# Altium schematic sheet bloodhound_gprs_0_beta.SchDoc
size A4
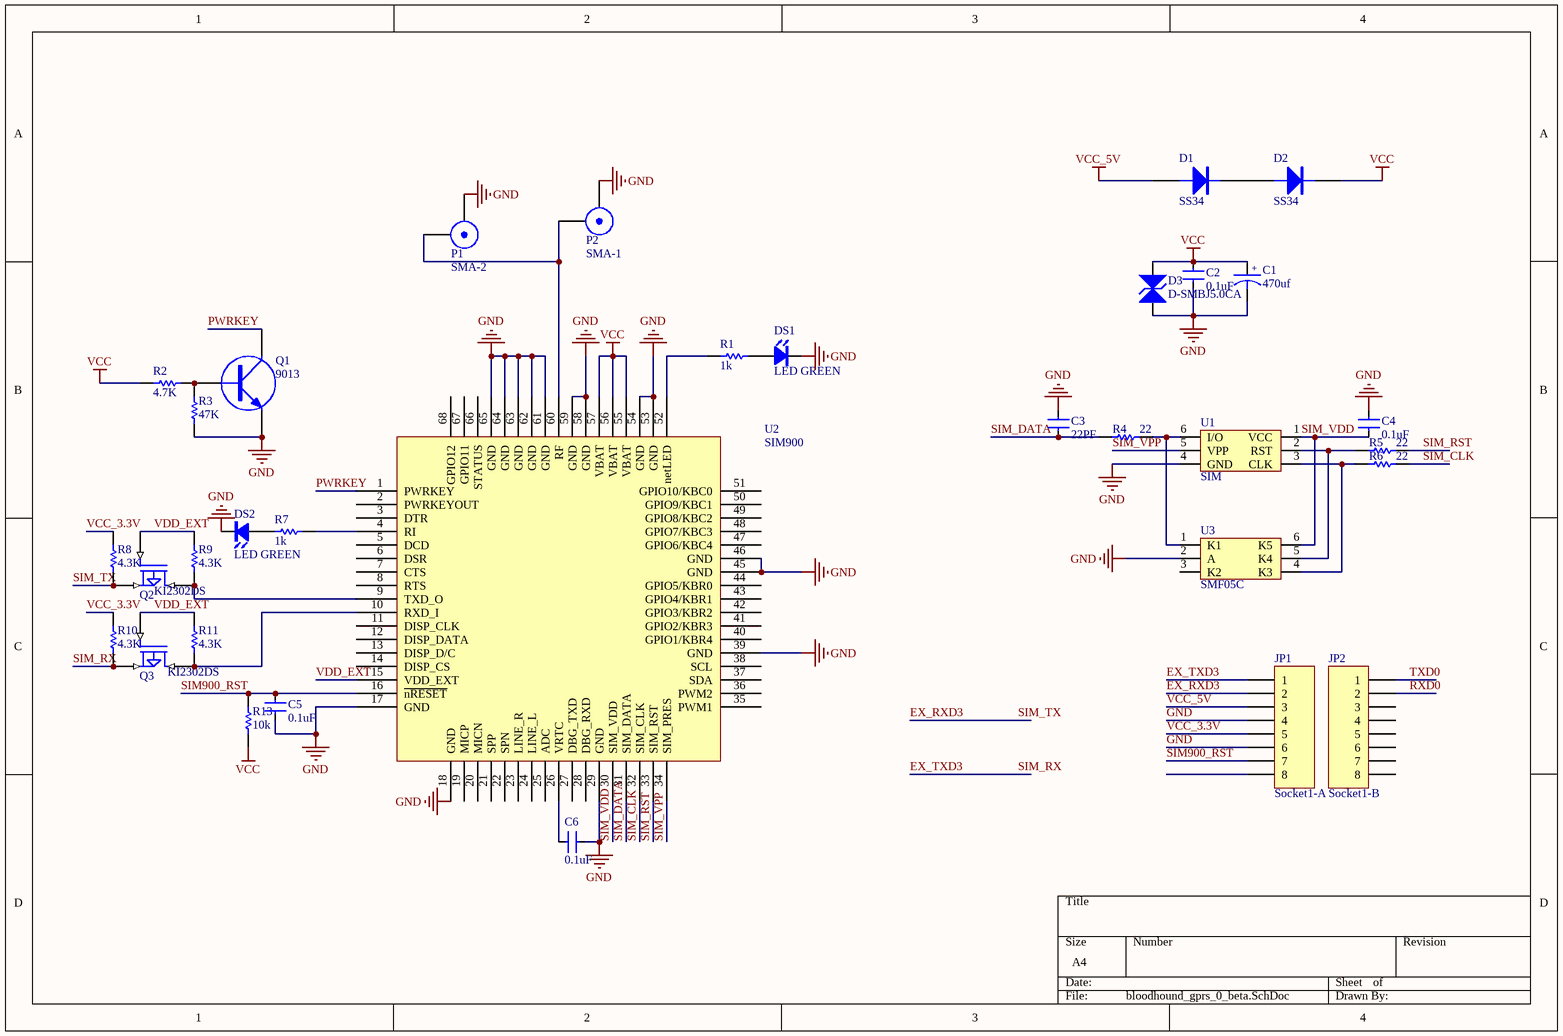
[diagram p0: bloodhound_gprs_0_beta.SchDoc]

## Parts
C1  470uf  [C7343]
C2  0.1uF  [C0603]
C3  22PF  [C0603]
C4  0.1uF  [C0603]
C5  0.1uF  [C0603]
C6  0.1uF  [C0603]
D1  SS34  [DO-214]
D2  SS34  [DO-214]
D3  D-SMBJ5.0CA  [DO-214]
DS1  LED GREEN  [D0805]
DS2  LED GREEN  [D0805]
JP1  Socket1-A  [SIP1x8x2.54]
JP2  Socket1-B  [SIP1x8x2.54]
P1  SMA-2  [IPX]
P2  SMA-1  [SMA-2]
Q1  9013  [SOT23-3L]
Q2  KI2302DS  [TSMT3]
Q3  KI2302DS  [TSMT3]
R1  1k  [R0603]
R2  4.7K  [R0603]
R3  47K  [R0603]
R4  22  [R0603]
R5  22  [R0603]
R6  22  [R0603]
R7  1k  [R0603]
R8  4.3K  [R0603]
R9  4.3K  [R0603]
R10  4.3K  [R0603]
R11  4.3K  [R0603]
R13  10k  [R0603]
U1  SIM  [SIM]
U2  SIM900  [GSM_900A]
U3  SMF05C  [SOT-363]

## Nets
GND: C1.2 C2.1 C3.2 C4.2 C5.2 C6.2 D3.A DS1.K DS2.K JP1.4 JP1.6 P1.2(Y) P2.2(Y) Q1.E R3.1 U1.4(GND) U2.17(GND) U2.18(GND) U2.29(GND) U2.39(GND) U2.45(GND) U2.46(GND) U2.53(GND) U2.54(GND) U2.58(GND) U2.59(GND) U2.61(GND) U2.62(GND) U2.63(GND) U2.64(GND) U2.65(GND) U3.2(A)
VCC: C1.1 C2.2 D2.2(K) D3.K R2.1 R13.2 U2.55(VBAT) U2.56(VBAT) U2.57(VBAT)
VCC_5V: D1.1(A) JP1.3
EX_RXD3: JP1.2 Q2.3(S) R8.2  [also labelled SIM_TX]
EX_TXD3: JP1.1 Q3.3(S) R10.2  [also labelled SIM_RX]
PWRKEY: Q1.C U2.1(PWRKEY)
RXD0: JP2.2
SIM900_RST: C5.1 JP1.7 R13.1 U2.16(~{nRESET})
SIM_CLK: R6.1 U2.32(SIM_CLK)
SIM_DATA: C3.1 R4.2 U2.31(SIM_DATA)
SIM_RST: R5.1 U2.33(SIM_RST)
SIM_VDD: C4.1 U1.1(VCC) U2.30(SIM_VDD) U3.6(K5)
SIM_VPP: U1.5(VPP) U2.34(SIM_PRES)
TXD0: JP2.1
VCC_3.3V: JP1.5 R8.1 R10.1
VDD_EXT: Q2.1(G) Q3.1(G) R9.1 R11.1 U2.15(VDD_EXT)
NetC6_1: C6.1 U2.26(VRTC)
NetD1_2: D1.2(K) D2.1(A)
NetDS1_A: DS1.A R1.1
NetDS2_A: DS2.A R7.1
NetP1_1: P1.1(X) P2.1(X) U2.60(RF)
NetQ1_B: Q1.B R2.2 R3.2
NetQ2_2: Q2.2(D) R9.2 U2.9(TXD_O)
NetQ3_2: Q3.2(D) R11.2 U2.10(RXD_I)
NetR1_2: R1.2 U2.52(netLED)
NetR4_1: R4.1 U1.6(I/O) U3.1(K1)
NetR5_2: R5.2 U1.2(RST) U3.5(K4)
NetR6_2: R6.2 U1.3(CLK) U3.4(K3)
NetR7_2: R7.2 U2.4(RI)

Not connected (* = marked no-connect by the designer): JP1 8; JP2 3 4 5 6 7 8; U2 2(PWRKEYOUT) 3(DTR) 5(DCD) 6(DSR) 7(CTS) 8(RTS) 11(DISP_CLK) 12(DISP_DATA) 13(DISP_D/C) 14(DISP_CS) 19(MICP) 20(MICN) 21(SPP) 22(SPN) 23(LINE_R) 24(LINE_L) 25(ADC) 27(DBG_TXD) 28(DBG_RXD) 35(PWM1) 36(PWM2) 37(SDA) 38(SCL) 40(GPIO1/KBR4) 41(GPIO2/KBR3) 42(GPIO3/KBR2) 43(GPIO4/KBR1) 44(GPIO5/KBR0) 47(GPIO6/KBC4) 48(GPIO7/KBC3) 49(GPIO8/KBC2) 50(GPIO9/KBC1) 51(GPIO10/KBC0) 66(STATUS) 67(GPIO11) 68(GPIO12); U3 3(K2)

## Notes on the sheet
- (in symbol CAP-T) +

## Library data of the parts
C1 = CAP-T: 钽电容
C2-C6 = CAP-SMD: SMD-CAP
  C2 C4-C6: Value: 0.1uF
  C3: Value: 22PF
D1 D2 = DIODE
D3 = D-SMBJ5.0CA: TVS
DS1 DS2 = LED
JP1 JP2 = SIP1X8: 2.0排针
P1 = BNC: IPX
P2 = BNC: SMB-KWE
Q1 = NPN: NPN Transistor
Q2 Q3 = MOSFET P: N MOSFET
R1-R11 R13 = RES: Resistor
  R1 R7: Value: 1k
  R2: Value: 4.7K
  R3: Value: 47K
  R4-R6: Value: 22
  R8-R11: Value: 4.3K
  R13: Value: 10k
U1 = SIM: 手机SIM卡
U3 = SMF05C: TVS